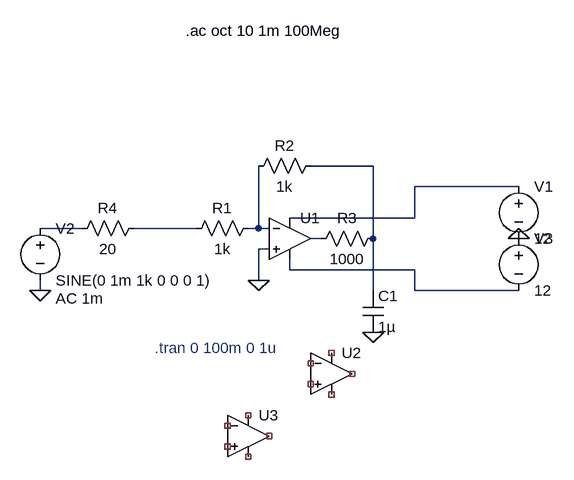
[diagram p0: schematic Draft1.asc]
Draft1.asc, the LTspice schematic file:
Version 4.1
SHEET 1 880 680
WIRE 320 64 224 64
WIRE 544 96 384 96
WIRE 384 144 384 96
WIRE 384 144 192 144
WIRE -128 160 -192 160
WIRE 48 160 -48 160
WIRE 144 160 144 64
WIRE 144 160 128 160
WIRE 160 160 144 160
WIRE 240 176 224 176
WIRE 320 176 320 64
WIRE 160 192 144 192
WIRE 192 224 192 208
WIRE 384 224 192 224
WIRE 144 240 144 192
WIRE -192 256 -192 240
WIRE 320 256 320 176
WIRE 384 256 384 224
WIRE 544 256 384 256
FLAG 144 240 0
FLAG 320 320 0
FLAG -192 256 0
FLAG 544 176 0
SYMBOL OpAmps\\UniversalOpAmp 192 176 R0
SYMATTR InstName U1
SYMATTR Value2 Avol=100k GBW=10Meg Vos=0
SYMATTR SpiceLine En=0 Enk=0 In=0 Ink=0 Rin=5000Meg
SYMBOL res 144 144 R90
WINDOW 0 0 56 VBottom 2
WINDOW 3 32 56 VTop 2
SYMATTR InstName R1
SYMATTR Value 1k
SYMBOL res 240 48 R90
WINDOW 0 0 56 VBottom 2
WINDOW 3 32 56 VTop 2
SYMATTR InstName R2
SYMATTR Value 1k
SYMBOL voltage 544 80 R0
WINDOW 123 0 0 Left 0
WINDOW 39 0 0 Left 0
SYMATTR InstName V1
SYMATTR Value 12
SYMBOL res 336 160 R90
WINDOW 0 0 56 VBottom 2
WINDOW 3 32 56 VTop 2
SYMATTR InstName R3
SYMATTR Value 1000
SYMBOL cap 304 256 R0
SYMATTR InstName C1
SYMATTR Value 1µ
SYMBOL voltage -192 144 R0
WINDOW 123 24 124 Left 2
WINDOW 39 0 0 Left 0
SYMATTR InstName V2
SYMATTR Value SINE(0 1m 1k 0 0 0 1)
SYMATTR Value2 AC 1m
SYMBOL voltage 544 160 R0
WINDOW 123 0 0 Left 0
WINDOW 39 0 0 Left 0
SYMATTR InstName V3
SYMATTR Value 12
SYMBOL res -32 144 R90
WINDOW 0 0 56 VBottom 2
WINDOW 3 32 56 VTop 2
SYMATTR InstName R4
SYMATTR Value 20
SYMBOL OpAmps\\UniversalOpAmp1 256 384 R0
SYMATTR InstName U2
SYMBOL OpAmps\\UniversalOpAmp2 128 480 R0
SYMATTR InstName U3
SYMATTR Value2 Avol=100k GBW=10Meg Slew=10000Meg
SYMATTR SpiceLine Ilimit=150m Rail=0 Vos=0
SYMATTR SpiceLine2 En=0 Enk=0 In=0 Ink=0 Rin=5000Meg
TEXT -16 344 Left 2 ;.tran 0 100m 0 1u
TEXT 32 -144 Left 2 !.ac oct 10 1m 100Meg

The netlist it stands for:
* Draft1.asc
X§U1 0 N005 N002 N007 N006 level1 Avol=100k GBW=10Meg Vos=0 En=0 Enk=0 In=0 Ink=0 Rin=5000Meg  ; pins In+ In- V+ V- OUT
R1 N005 N004 1k
R2 N001 N005 1k
V1 N002 0 12
R3 N001 N006 1000
C1 N001 0 1µ
V2 N003 0 SINE(0 1m 1k 0 0 0 1) AC 1m
V3 0 N007 12
R4 N004 N003 20
X§U2 NC_01 NC_02 NC_03 NC_04 NC_05 level1 Avol=1Meg GBW=10Meg Vos=0 En=0 Enk=0 In=0 Ink=0 Rin=500Meg  ; pins In+ In- V+ V- OUT
X§U3 NC_06 NC_07 NC_08 NC_09 NC_10 level2 Avol=100k GBW=10Meg Slew=10000Meg Ilimit=150m Rail=0 Vos=0 En=0 Enk=0 In=0 Ink=0 Rin=5000Meg  ; pins In+ In- V+ V- OUT
* .tran 0 100m 0 1u
.ac oct 10 1m 100Meg
.lib UniversalOpAmp1.lib
.lib UniversalOpAmp2.lib
.backanno
.end